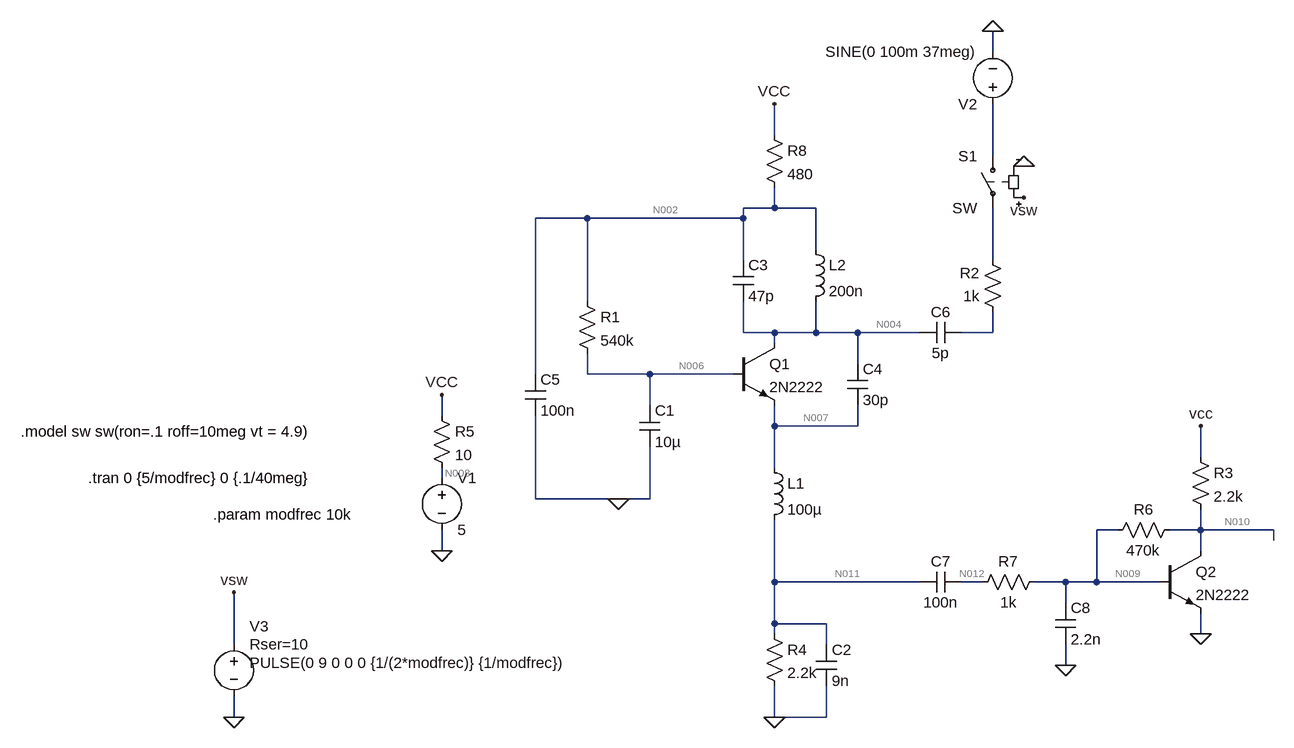
[diagram p0: schematic Super-regen2.asc]
Super-regen2.asc, the LTspice schematic file:
Version 4
SHEET 1 1464 756
WIRE 768 -320 768 -352
WIRE 432 -192 432 -240
WIRE 768 -160 768 -240
WIRE 432 -80 432 -112
WIRE 432 -80 384 -80
WIRE 496 -80 432 -80
WIRE 144 -64 64 -64
WIRE 384 -64 384 -80
WIRE 384 -64 144 -64
WIRE 496 -16 496 -80
WIRE 384 0 384 -64
WIRE 768 0 768 -80
WIRE 144 64 144 -64
WIRE 384 112 384 64
WIRE 432 112 384 112
WIRE 496 112 496 64
WIRE 496 112 432 112
WIRE 560 112 496 112
WIRE 656 112 560 112
WIRE 768 112 768 80
WIRE 768 112 720 112
WIRE 432 128 432 112
WIRE 560 160 560 112
WIRE 64 176 64 -64
WIRE 144 176 144 144
WIRE 240 176 144 176
WIRE 368 176 240 176
WIRE 240 224 240 176
WIRE -80 240 -80 208
WIRE 432 256 432 224
WIRE 560 256 560 224
WIRE 560 256 432 256
WIRE 1088 304 1088 256
WIRE 432 320 432 256
WIRE -80 336 -80 320
WIRE 64 368 64 240
WIRE 192 368 64 368
WIRE 240 368 240 288
WIRE 240 368 192 368
WIRE 960 416 928 416
WIRE 1088 416 1088 384
WIRE 1088 416 1040 416
WIRE 1200 416 1088 416
WIRE 1200 432 1200 416
WIRE -80 448 -80 416
WIRE 1088 448 1088 416
WIRE 432 496 432 400
WIRE 656 496 432 496
WIRE 752 496 720 496
WIRE 880 496 832 496
WIRE 928 496 928 416
WIRE 928 496 880 496
WIRE 1024 496 928 496
WIRE 880 528 880 496
WIRE 432 560 432 496
WIRE 512 560 432 560
WIRE 432 576 432 560
WIRE 1088 576 1088 544
WIRE -400 592 -400 512
WIRE 512 592 512 560
WIRE 880 624 880 592
WIRE -400 704 -400 672
WIRE 432 704 432 656
WIRE 512 704 512 656
WIRE 512 704 432 704
FLAG 432 704 0
FLAG -80 448 0
FLAG -80 208 VCC
FLAG 432 -240 VCC
FLAG 192 368 0
FLAG 768 -352 0
FLAG 816 -144 0
FLAG 816 -96 vsw
FLAG -400 704 0
FLAG -400 512 vsw
FLAG 1088 576 0
FLAG 1088 256 vcc
FLAG 880 624 0
SYMBOL res 128 48 R0
SYMATTR InstName R1
SYMATTR Value 540k
SYMBOL cap 224 224 R0
SYMATTR InstName C1
SYMATTR Value 10µ
SYMBOL npn 368 128 R0
SYMATTR InstName Q1
SYMATTR Value 2N2222
SYMBOL res 416 560 R0
SYMATTR InstName R4
SYMATTR Value 2.2k
SYMBOL cap 496 592 R0
SYMATTR InstName C2
SYMATTR Value 9n
SYMBOL ind 416 304 R0
SYMATTR InstName L1
SYMATTR Value 100µ
SYMBOL ind 480 -32 R0
SYMATTR InstName L2
SYMATTR Value 200n
SYMBOL cap 368 0 R0
SYMATTR InstName C3
SYMATTR Value 47p
SYMBOL voltage -80 320 R0
WINDOW 123 0 0 Left 0
WINDOW 39 0 0 Left 0
SYMATTR InstName V1
SYMATTR Value 5
SYMBOL res -96 224 R0
SYMATTR InstName R5
SYMATTR Value 10
SYMBOL cap 544 160 R0
SYMATTR InstName C4
SYMATTR Value 30p
SYMBOL res 416 -208 R0
SYMATTR InstName R8
SYMATTR Value 480
SYMBOL cap 48 176 R0
SYMATTR InstName C5
SYMATTR Value 100n
SYMBOL voltage 768 -224 R180
WINDOW 123 0 0 Left 0
WINDOW 39 0 0 Left 0
SYMATTR InstName V2
SYMATTR Value SINE(0 100m 37meg)
SYMBOL res 784 96 R180
WINDOW 0 36 76 Left 2
WINDOW 3 36 40 Left 2
SYMATTR InstName R2
SYMATTR Value 1k
SYMBOL cap 720 128 M270
WINDOW 0 32 32 VTop 2
WINDOW 3 0 32 VBottom 2
SYMATTR InstName C6
SYMATTR Value 5p
SYMBOL sw 768 -176 M0
SYMATTR InstName S1
SYMBOL voltage -400 576 R0
WINDOW 3 24 44 Left 2
WINDOW 123 0 0 Left 0
WINDOW 39 24 16 Left 2
WINDOW 0 24 -12 Left 2
SYMATTR Value PULSE(0 9 0 0 0 {1/(2*modfrec)} {1/modfrec})
SYMATTR SpiceLine Rser=10
SYMATTR InstName V3
SYMBOL npn 1024 448 R0
SYMATTR InstName Q2
SYMATTR Value 2N2222
SYMBOL res 1072 288 R0
SYMATTR InstName R3
SYMATTR Value 2.2k
SYMBOL res 1056 400 R90
WINDOW 0 0 56 VBottom 2
WINDOW 3 32 56 VTop 2
SYMATTR InstName R6
SYMATTR Value 470k
SYMBOL cap 720 480 R90
WINDOW 0 0 32 VBottom 2
WINDOW 3 32 32 VTop 2
SYMATTR InstName C7
SYMATTR Value 100n
SYMBOL res 848 480 R90
WINDOW 0 0 56 VBottom 2
WINDOW 3 32 56 VTop 2
SYMATTR InstName R7
SYMATTR Value 1k
SYMBOL cap 864 528 R0
SYMATTR InstName C8
SYMATTR Value 2.2n
TEXT -728 264 Left 2 !.model sw sw(ron=.1 roff=10meg vt = 4.9)
TEXT -432 392 Left 2 !.param modfrec 10k
TEXT -624 336 Left 2 !.tran 0 {5/modfrec} 0 {.1/40meg}

The netlist it stands for:
* Super-regen2.asc
R1 N002 N006 540k
C1 N006 0 10µ
Q1 N004 N006 N007 0 2N2222
R4 N011 0 2.2k
C2 N011 0 9n
L1 N007 N011 100µ
L2 N002 N004 200n
C3 N002 N004 47p
V1 N008 0 5
R5 VCC N008 10
C4 N004 N007 30p
R8 VCC N002 480
C5 N002 0 100n
V2 N001 0 SINE(0 100m 37meg)
R2 N005 N003 1k
C6 N005 N004 5p
S1 N001 N003 vsw 0 SW
V3 vsw 0 PULSE(0 9 0 0 0 {1/(2*modfrec)} {1/modfrec}) Rser=10
Q2 N010 N009 0 0 2N2222
R3 VCC N010 2.2k
R6 N010 N009 470k
C7 N012 N011 100n
R7 N009 N012 1k
C8 N009 0 2.2n
.model NPN NPN
.model PNP PNP
.lib standard.bjt
.model sw sw(ron=.1 roff=10meg vt = 4.9)
.param modfrec 10k
.tran 0 {5/modfrec} 0 {.1/40meg}
.backanno
.end

* Results of the author's LTspice run, read from the files saved beside the schematic
* Operating Point, zero values left out:
*   V(n002) = 4.591 V
*   V(n006) = 2.442 V
*   V(n004) = 4.591 V
*   V(n007) = 1.793 V
*   V(n011) = 1.793 V
*   V(n008) = 5 V
*   V(vcc) = 4.982 V
*   V(n010) = 2.864 V
*   V(n009) = 653.8 mV
*   V(n012) = 653.8 mV
*   Ic(Q1) = 810.9 µA
*   Ib(Q1) = 3.98 µA
*   Ie(Q1) = -814.9 µA
*   Ic(Q2) = 958.2 µA
*   Ib(Q2) = 4.702 µA
*   Ie(Q2) = -962.9 µA
*   I(L1) = 814.9 µA
*   I(L2) = 810.9 µA
*   I(R1) = 3.98 µA
*   I(R4) = 814.9 µA
*   I(R5) = -1.778 mA
*   I(R8) = 814.9 µA
*   I(R3) = 962.9 µA
*   I(R6) = 4.702 µA
*   I(V1) = -1.778 mA